# Altium schematic sheet 2_P2.schdoc.schdoc
size 220 x 160 mm; Symbol: Sheet-Symbol_A4; Device: Sheet-Symbol_A4; Company: 嘉立创EDA; Version: V1.0; Page Size: A4; @Project Name: 2024毕设; @Page Count: 2; @Update Date: 2024-05-17; @Create Date: 2024-05-17; @Schematic Name: 智能输液器主板; @Page No: 2; @Page Name: P3
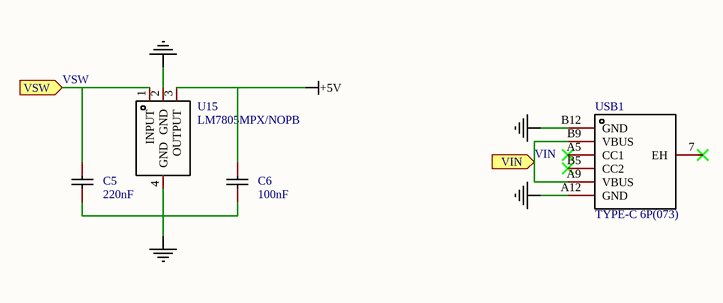
[diagram p0: 2_P2.schdoc.schdoc]

## Parts
C5  220nF  [C0805]
C6  100nF  [C0805]
U15  LM7805MPX/NOPB  [SOT-223-4_L6.5-W3.5-P2.30-LS7.0-BR]
USB1  TYPE-C 6P(073)  [TYPE-C-SMD_TYPE-C-6P]

## Ports
VIN (in), VSW (in)

## Nets
+5V: C6.2 U15.3(OUTPUT)
NetC5_1: C5.1 C6.1 U15.2(GND) U15.4(GND) USB1.A12(GND) USB1.B12(GND)
VIN: USB1.A9(VBUS) USB1.B9(VBUS) ; port VIN
VSW: C5.2 U15.1(INPUT) ; port VSW

Not connected (* = marked no-connect by the designer): USB1 7(EH)* A5(CC1)* B5(CC2)*

## Notes on the sheet
- 1
- 2
- 3
- 4
- 5
- 6
- A
- B
- C
- 原理图
- 智能输液器主板
- 创建日期
- 更新日期
- 2024-05-17
- 审阅
- 绘制
- 图页
- P3
- 物料编码
- 2024毕设
- D
- 版本
- 尺寸
- 页
- 共
- V1.0
- A4
- 嘉立创EDA

## Library data of the parts
C5 = CL21B224KBFNNNE: Manufacturer: SAMSUNG(三星); Add into BOM: yes; Tolerance: ±10%; Voltage Rated: 50V; Temperature Coefficient: X7R; Description: 容值:220nF;精度:±10%;额定电压:50V;材质(温度系数):X7R;; Name: 220nF; Symbol: CL21B224KBFNNNE; Device: CL21B224KBFNNNE; Supplier: LCSC; Manufacturer Part: CL21B224KBFNNNE; Value: 220nF; Supplier Part: C5378; JLCPCB Part Class: 基础库; LCSC Part Name: 220nF ±10% 50V; Supplier Footprint: 0805; Datasheet: https://atta.szlcsc.com/upload/public/pdf/source/20160218/1457707763339.pdf; Convert to PCB: yes
C6 = CC0805KRX7R9BB104: Manufacturer: YAGEO(国巨); Add into BOM: yes; Tolerance: ±10%; Voltage Rated: 50V; Temperature Coefficient: X7R; Description: 容值:100nF;精度:±10%;额定电压:50V;材质(温度系数):X7R;; Name: 100nF; Symbol: CC0805KRX7R9BB104; Device: CC0805KRX7R9BB104; LCSC Part Name: 100nF ±10% 50V; Supplier Part: C49678; Manufacturer Part: CC0805KRX7R9BB104; Supplier Footprint: 0805; JLCPCB Part Class: 基础库; Datasheet: https://atta.szlcsc.com/upload/public/pdf/source/20180224/C181747_15194369449651363981.pdf; Supplier: LCSC; Convert to PCB: yes; Value: 100nF
U15 = LM7805MPX/NOPB: Manufacturer: TI(德州仪器); Add into BOM: yes; Output Type: 固定; Maximum Input Voltage: 35V; Output Voltage: 5V; MAX Output Current: 1.5A; Power Supply Rejection Ratio (PSRR): 80dB@(120Hz); Dropout Voltage: 2V@(1A); standby current: 8mA; Output Polarity: 正极; Number of Outputs: 1; Description: 输出类型:固定;最大输入电压:35V;输出电压:5V;最大输出电流:1.5A;电源纹波抑制比(PSRR):80dB@(120Hz);输出极性:正极;; Name: LM7805MPX/NOPB; Symbol: LM7805MPX/NOPB; Device: LM7805MPX/NOPB; LCSC Part Name: LM7805MPX/NOPB; Supplier Part: C2848241; Manufacturer Part: LM7805MPX/NOPB; Supplier Footprint: SOT-223-4; JLCPCB Part Class: 扩展库; Datasheet: https://www.ti.com/cn/lit/gpn/lm7800; Supplier: LCSC; Convert to PCB: yes; Operating Temperature: 0℃~+125℃
USB1 = TYPE-C 6P(073): Manufacturer: SHOU HAN(首韩); Add into BOM: yes; Gender: 母; Number of Ports: 1; Current Rating - Power (Max): 5A; Description: 连接器类型:Type-C;标准:-;公母:母;端口数量:1;触点数量:6P;安装方式:卧贴;额定电流 - 电源:5A;工作温度范围:-25℃~+85℃;; Name: TYPE-C 6P(073); Symbol: TYPE-C 6P(073); Device: TYPE-C 6P(073); Supplier: LCSC; Supplier Part: C668623; Manufacturer Part: TYPE-C 6P(073); JLCPCB Part Class: 扩展库; LCSC Part Name: Type-C 母 卧贴; Supplier Footprint: SMD; Datasheet: https://atta.szlcsc.com/upload/public/pdf/source/20200618/C668623_A4B260DED7AC1949BAC6AE39E9F4CD80.pdf; Convert to PCB: yes; Connector Type: Type-C; Standard: -; Number of Contacts: 6P; Mounting Style: 卧贴; Operating Temperature Range: -25℃~+85℃